# Altium schematic sheet Ada - Sensor - COVERSHEET 4.0.SchDoc: Title
size A3; DrawnBy: Name; DocumentNumber: 1; Revision: A; SheetNumber: 1; SheetTotal: 3
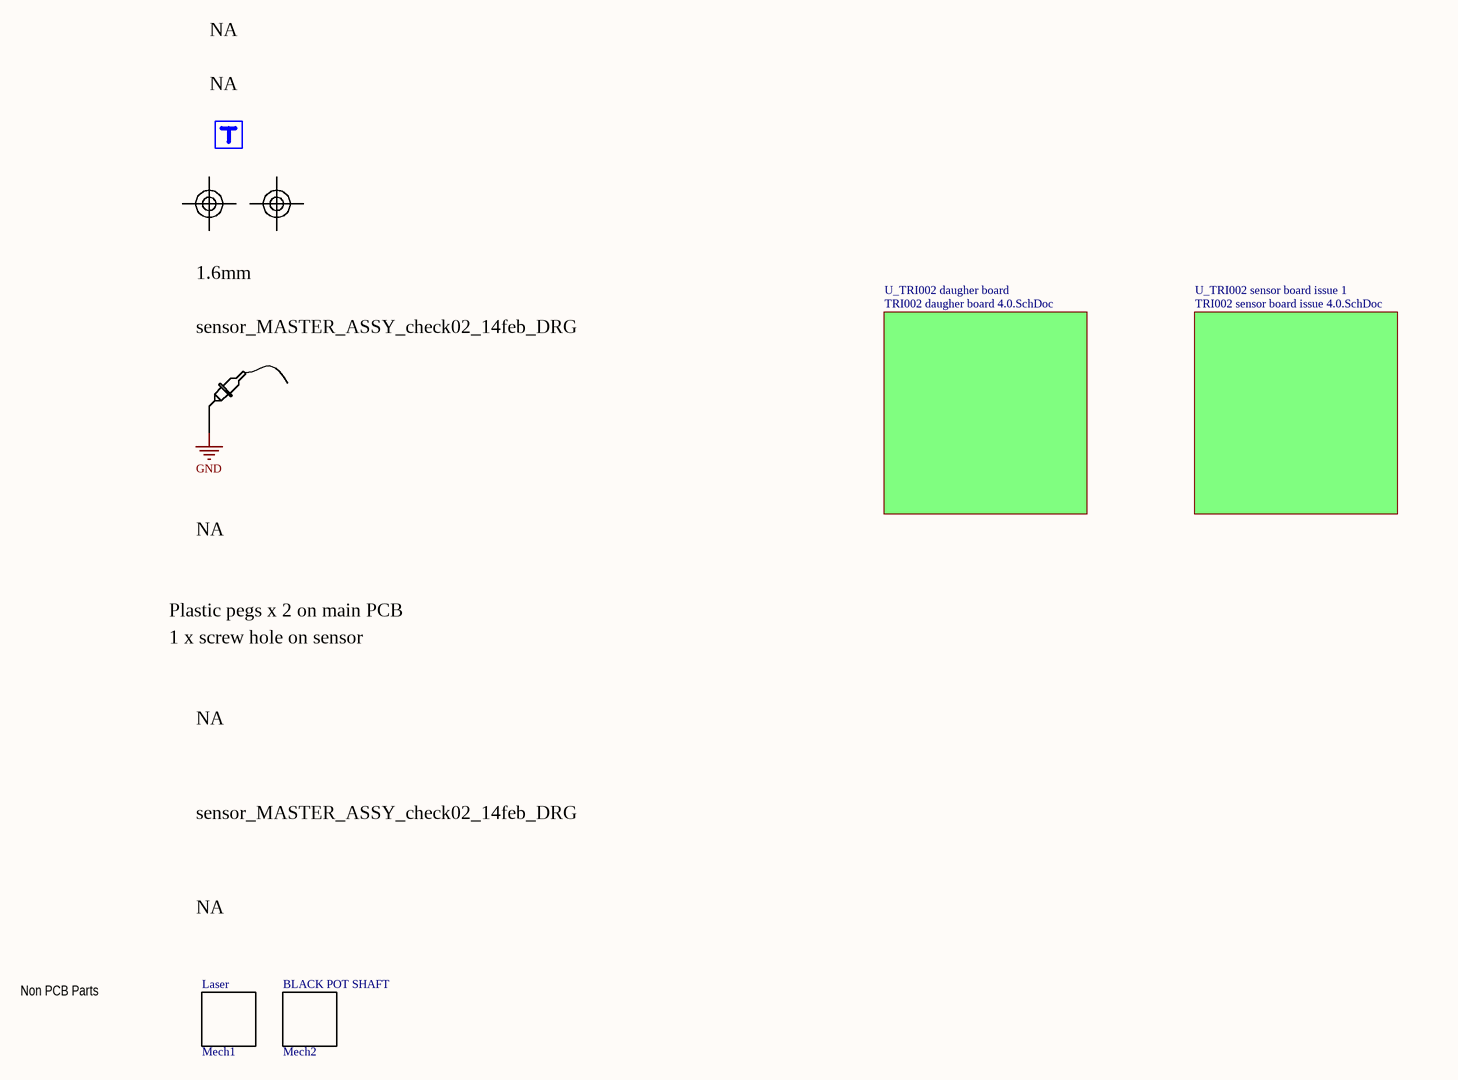
[diagram p0: Ada - Sensor - COVERSHEET 4.0.SchDoc]

## Parts
Fiducial_1  Fiducial  [FMARK]  (value not drawn)  (no BOM)
Fiducial_2  Fiducial  [FMARK]  (value not drawn)  (no BOM)
Mech1  value Laser  [NON PCB PART]  (hidden comment: Mish Mech)  (mechanical)
Mech2  value BLACK POT SHAFT  [NON PCB PART]  (hidden comment: Mish Mech)  (mechanical)
SP  Scope GND point  [Scope GND point]  (value not drawn)  (no BOM)
TR1  trace label  [TraceLabel]  (value not drawn)  (no BOM)

## Sub-sheets
U_TRI002 daugher board = TRI002 daugher board 4.0.SchDoc: no entries
U_TRI002 sensor board issue 1 = TRI002 sensor board issue 4.0.SchDoc: no entries

## Nets
GND: SP.1

## Notes on the sheet
- NA
- (near TR1) NA
- 1.6mm
- sensor_MASTER_ASSY_check02_14feb_DRG
- Plastic pegs x 2 on main PCB
- 1 x screw hole on sensor
- Non PCB Parts
- Test rig fixing holes
- PCB CHECKLIST
- BOARD MARKER
- TRACE LABEL
- FIDUCIALS
- PCB THICKNESS
- [x] mm
- PCB DIMENSIONS
- [x] mm X [x] mm
- SCOPE GROUND
- POINT
- [NET]
- ENCLOSURE
- Mounting holes
- PCB Clearances
- PCB outline ref doc
- Logo on silkscreen
- N.B. LED Cathodes are identified, assembler to refer to part datasheet for correct orientation
- NOTES
- Project Name:
- Project Number:
- Title:
- Size:
- Date:
- A3
- Number:
- Time:
- Sheet
- Drawn by:
- of
- Version:
- File:

## Library data of the parts
Fiducial_1 Fiducial_2 = F Mark: Value: Fiducial
Mech1 = Mish Mech: Laser; Manufacturer: NA; Part No.: 650nm 5mW 3V Laser Dot Diode Module Head WL Red; Manuf Part #: NA; Supplier: http://www.aliexpress.com/item/100-pcs-mini-650nm-5mW-3V-Laser-Dot-Diode-Module-Head-WL-Red/896433799.html
Mech2 = Mish Mech: BLACK POT SHAFT; Manufacturer: Iskra; Manuf Part #: 88 131 387; Part No.: 67-0480; Supplier: Rapid
SP = Scope GND point: Scope probe earth point